# Altium schematic sheet ewctrl-mini.schdoc
size 282 x 194 mm
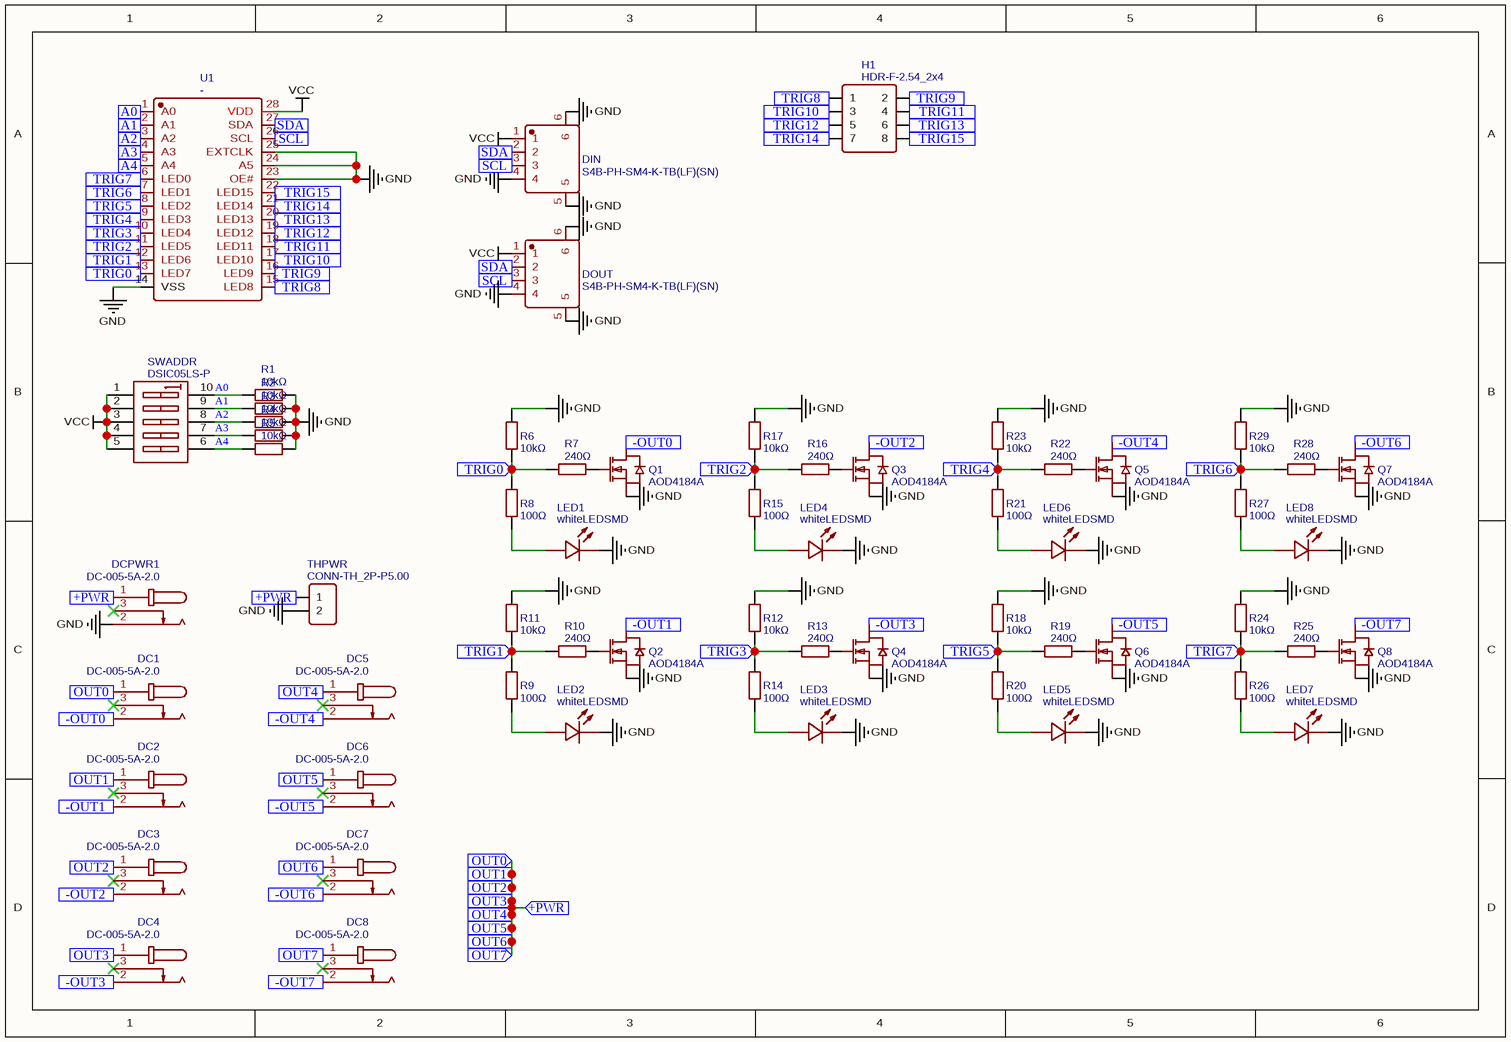
[diagram p0: ewctrl-mini.schdoc]

## Parts
DC1  DC-005-5A-2.0  [DC-IN-TH_DC-005-5A-2.0]
DC2  DC-005-5A-2.0  [DC-IN-TH_DC-005-5A-2.0]
DC3  DC-005-5A-2.0  [DC-IN-TH_DC-005-5A-2.0]
DC4  DC-005-5A-2.0  [DC-IN-TH_DC-005-5A-2.0]
DC5  DC-005-5A-2.0  [DC-IN-TH_DC-005-5A-2.0]
DC6  DC-005-5A-2.0  [DC-IN-TH_DC-005-5A-2.0]
DC7  DC-005-5A-2.0  [DC-IN-TH_DC-005-5A-2.0]
DC8  DC-005-5A-2.0  [DC-IN-TH_DC-005-5A-2.0]
DCPWR1  DC-005-5A-2.0  [DC-IN-TH_DC-005-5A-2.0]
DIN  S4B-PH-SM4-K-TB(LF)(SN)  [CONN-SMD_S4B-PH-SM4-K-TB-LF-SN]
DOUT  S4B-PH-SM4-K-TB(LF)(SN)  [CONN-SMD_S4B-PH-SM4-K-TB-LF-SN]
H1  HDR-F-2.54_2x4  [HDR-F-2.54_2X4]
LED1  whiteLEDSMD  [LED0805-R-RD]
LED2  whiteLEDSMD  [LED0805-R-RD]
LED3  whiteLEDSMD  [LED0805-R-RD]
LED4  whiteLEDSMD  [LED0805-R-RD]
LED5  whiteLEDSMD  [LED0805-R-RD]
LED6  whiteLEDSMD  [LED0805-R-RD]
LED7  whiteLEDSMD  [LED0805-R-RD]
LED8  whiteLEDSMD  [LED0805-R-RD]
Q1  AOD4184A  [TO-252-2_L6.6-W6.1-P4.57-LS9.9-TL-CW]
Q2  AOD4184A  [TO-252-2_L6.6-W6.1-P4.57-LS9.9-TL-CW]
Q3  AOD4184A  [TO-252-2_L6.6-W6.1-P4.57-LS9.9-TL-CW]
Q4  AOD4184A  [TO-252-2_L6.6-W6.1-P4.57-LS9.9-TL-CW]
Q5  AOD4184A  [TO-252-2_L6.6-W6.1-P4.57-LS9.9-TL-CW]
Q6  AOD4184A  [TO-252-2_L6.6-W6.1-P4.57-LS9.9-TL-CW]
Q7  AOD4184A  [TO-252-2_L6.6-W6.1-P4.57-LS9.9-TL-CW]
Q8  AOD4184A  [TO-252-2_L6.6-W6.1-P4.57-LS9.9-TL-CW]
R1  10kΩ  [R0603]
R2  10kΩ  [R0603]
R3  10kΩ  [R0603]
R4  10kΩ  [R0603]
R5  10kΩ  [R0603]
R6  10kΩ  [R0603]
R7  240Ω  [R0603]
R8  100Ω  [R0603]
R9  100Ω  [R0603]
R10  240Ω  [R0603]
R11  10kΩ  [R0603]
R12  10kΩ  [R0603]
R13  240Ω  [R0603]
R14  100Ω  [R0603]
R15  100Ω  [R0603]
R16  240Ω  [R0603]
R17  10kΩ  [R0603]
R18  10kΩ  [R0603]
R19  240Ω  [R0603]
R20  100Ω  [R0603]
R21  100Ω  [R0603]
R22  240Ω  [R0603]
R23  10kΩ  [R0603]
R24  10kΩ  [R0603]
R25  240Ω  [R0603]
R26  100Ω  [R0603]
R27  100Ω  [R0603]
R28  240Ω  [R0603]
R29  10kΩ  [R0603]
SWADDR  DSIC05LS-P  [SW-SMD_DSIC05LS-P]
THPWR  CONN-TH_2P-P5.00  [CONN-TH_2P-P5.00]
U1  -  [TSSOP-28_L9.7-W4.4-P0.65-LS6.4-TL]

## Ports
+PWR (in), -OUT0 (in), -OUT1 (in), -OUT2 (in), -OUT3 (in), -OUT4 (in), -OUT5 (in), -OUT6 (in), -OUT7 (in), A0 (in), A1 (in), A2 (in), A3 (in), A4 (in), OUT0 (in), OUT1 (in), OUT2 (in), OUT3 (in), OUT4 (in), OUT5 (in), OUT6 (in), OUT7 (in), SCL (in), SDA (in), TRIG0 (in), TRIG1 (in), TRIG2 (in), TRIG3 (in), TRIG4 (in), TRIG5 (in), TRIG6 (in), TRIG7 (in), TRIG8 (in), TRIG9 (in), TRIG10 (in), TRIG11 (in), TRIG12 (in), TRIG13 (in), TRIG14 (in), TRIG15 (in)

## Nets
GND: DCPWR1.2 DIN.4 DIN.5 DIN.6 DOUT.4 DOUT.5 DOUT.6 LED1.2(K) LED2.2(K) LED3.2(K) LED4.2(K) LED5.2(K) LED6.2(K) LED7.2(K) LED8.2(K) Q1.3(S) Q2.3(S) Q3.3(S) Q4.3(S) Q5.3(S) Q6.3(S) Q7.3(S) Q8.3(S) R1.2 R2.2 R3.2 R4.2 R5.2 R6.2 R11.2 R12.2 R17.2 R18.2 R23.2 R24.2 R29.2 THPWR.2 U1.14(VSS) U1.23(OE#) U1.24(A5) U1.25(EXTCLK)
VCC: DIN.1 DOUT.1 SWADDR.1(A1) SWADDR.2(A2) SWADDR.3(A3) SWADDR.4(A4) SWADDR.5(A5) U1.28(VDD)
+PWR: DC1.1 DC2.1 DC3.1 DC4.1 DC5.1 DC6.1 DC7.1 DC8.1 DCPWR1.1 THPWR.1 ; port OUT0, port OUT1, port OUT2, port OUT3, port OUT4, port OUT5, port OUT6, port OUT7, port +PWR
-OUT0: DC1.2 Q1.2(D) ; port -OUT0
-OUT1: DC2.2 Q2.2(D) ; port -OUT1
-OUT2: DC3.2 Q3.2(D) ; port -OUT2
-OUT3: DC4.2 Q4.2(D) ; port -OUT3
-OUT4: DC5.2 Q5.2(D) ; port -OUT4
-OUT5: DC6.2 Q6.2(D) ; port -OUT5
-OUT6: DC7.2 Q7.2(D) ; port -OUT6
-OUT7: DC8.2 Q8.2(D) ; port -OUT7
A0: U1.1(A0) ; port A0
A0: R1.1 SWADDR.10(B1)  [a separate net that carries the same name]
A1: U1.2(A1) ; port A1
A1: R2.1 SWADDR.9(B2)  [a separate net that carries the same name]
A2: U1.3(A2) ; port A2
A2: R3.1 SWADDR.8(B3)  [a separate net that carries the same name]
A3: U1.4(A3) ; port A3
A3: R4.1 SWADDR.7(B4)  [a separate net that carries the same name]
A4: U1.5(A4) ; port A4
A4: R5.1 SWADDR.6(B5)  [a separate net that carries the same name]
SCL: DIN.3 DOUT.3 U1.26(SCL) ; port SCL
SDA: DIN.2 DOUT.2 U1.27(SDA) ; port SDA
TRIG0: R6.1 R7.1 R8.2 U1.13(LED7) ; port TRIG0
TRIG1: R9.2 R10.1 R11.1 U1.12(LED6) ; port TRIG1
TRIG2: R15.2 R16.1 R17.1 U1.11(LED5) ; port TRIG2
TRIG3: R12.1 R13.1 R14.2 U1.10(LED4) ; port TRIG3
TRIG4: R21.2 R22.1 R23.1 U1.9(LED3) ; port TRIG4
TRIG5: R18.1 R19.1 R20.2 U1.8(LED2) ; port TRIG5
TRIG6: R27.2 R28.1 R29.1 U1.7(LED1) ; port TRIG6
TRIG7: R24.1 R25.1 R26.2 U1.6(LED0) ; port TRIG7
TRIG8: H1.1 U1.15(LED8) ; port TRIG8
TRIG9: H1.2 U1.16(LED9) ; port TRIG9
TRIG10: H1.3 U1.17(LED10) ; port TRIG10
TRIG11: H1.4 U1.18(LED11) ; port TRIG11
TRIG12: H1.5 U1.19(LED12) ; port TRIG12
TRIG13: H1.6 U1.20(LED13) ; port TRIG13
TRIG14: H1.7 U1.21(LED14) ; port TRIG14
TRIG15: H1.8 U1.22(LED15) ; port TRIG15
NetLED1_1: LED1.1(A) R8.1
NetLED2_1: LED2.1(A) R9.1
NetLED3_1: LED3.1(A) R14.1
NetLED4_1: LED4.1(A) R15.1
NetLED5_1: LED5.1(A) R20.1
NetLED6_1: LED6.1(A) R21.1
NetLED7_1: LED7.1(A) R26.1
NetLED8_1: LED8.1(A) R27.1
NetQ1_1: Q1.1(G) R7.2
NetQ2_1: Q2.1(G) R10.2
NetQ3_1: Q3.1(G) R16.2
NetQ4_1: Q4.1(G) R13.2
NetQ5_1: Q5.1(G) R22.2
NetQ6_1: Q6.1(G) R19.2
NetQ7_1: Q7.1(G) R28.2
NetQ8_1: Q8.1(G) R25.2

Not connected (* = marked no-connect by the designer): DC1 3*; DC2 3*; DC3 3*; DC4 3*; DC5 3*; DC6 3*; DC7 3*; DC8 3*; DCPWR1 3*

## Library data of the parts
DC1-DC8 DCPWR1 = DC-005-5A-2.0: Manufacturer: XKB Connectivity(中国星坤); Contributor: LCSC; Supplier: LCSC; Supplier Part: C381116; Manufacturer Part: DC-005-5A-2.0; JLCPCB Part Class: Extended Part; spicePre: D; spiceSymbolName: DC-005-5A-2.0
DIN DOUT = S4B-PH-SM4-K-TB(LF)(SN): Manufacturer: JST; Contributor: LCSC; Supplier: LCSC; Supplier Part: C265332; Manufacturer Part: S4B-PH-SM4-K-TB(LF)(SN); JLCPCB Part Class: Extended Part; spicePre: U; spiceSymbolName: S4B-PH-SM4-K-TB(LF)(SN)
H1 = HDR-F-2.54_2x4: Contributor: LCEDA_Lib; Supplier Part: C239344; Supplier: LCSC; spicePre: H; spiceSymbolName: HDR-F-2.54_2x4
LED1-LED8 = whiteLEDSMD: Manufacturer: KENTO; Manufacturer Part: KT-0805W; Supplier: LCSC; Supplier Part: C34499; JLCPCB Part Class: Basic Part; spicePre: L; spiceSymbolName: whiteLEDSMD
Q1-Q8 = AOD4184A: Manufacturer: AOS; Contributor: LCSC; Supplier: LCSC; Manufacturer Part: AOD4184A; Supplier Part: C99124; JLCPCB Part Class: Extended Part; spicePre: Q; spiceSymbolName: AOD4184A
R1-R6 R11 R12 R17 R18 R23 R24 R29 = 10kΩ: Manufacturer: UNI-ROYAL(厚声); Manufacturer Part: 0603WAF1002T5E; nameAlias: Value; Supplier: LCSC; Supplier Part: C25804; JLCPCB Part Class: Basic Part; spicePre: R; spiceSymbolName: 0603WAF1002T5E
R7 R10 R13 R16 R19 R22 R25 R28 = 240Ω: Manufacturer: UNI-ROYAL(厚声); Manufacturer Part: 0603WAF2400T5E; nameAlias: Value; Supplier: LCSC; Supplier Part: C23350; JLCPCB Part Class: Extended Part; spicePre: R; spiceSymbolName: 0603WAF2400T5E
R8 R9 R14 R15 R20 R21 R26 R27 = 100Ω: Manufacturer: UNI-ROYAL(厚声); Manufacturer Part: 0603WAF1000T5E; nameAlias: Value; Supplier: LCSC; Supplier Part: C22775; JLCPCB Part Class: Basic Part; spicePre: R; spiceSymbolName: 0603WAF1000T5E
SWADDR = DSIC05LS-P: Manufacturer: XKB Connectivity(中国星坤); Contributor: LCSC; Supplier: LCSC; Supplier Part: C319036; Manufacturer Part: DSIC05LS-P; JLCPCB Part Class: Extended Part; spicePre: S; spiceSymbolName: DSIC05LS-P
THPWR = CONN-TH_2P-P5.00: Contributor: LCEDA_Lib; Supplier: LCSC; spicePre: P; spiceSymbolName: CONN-TH_2P-P5.00
U1 = -: Manufacturer: NXP(恩智浦); Manufacturer Part: PCA9685PW,118; Contributor: LCSC; nameAlias: Value; Supplier: LCSC; Supplier Part: C2678753; JLCPCB Part Class: Extended Part; spicePre: U; spiceSymbolName: PCA9685PW,118